# EAGLE design desk-controller (EAGLE 9.6.2)
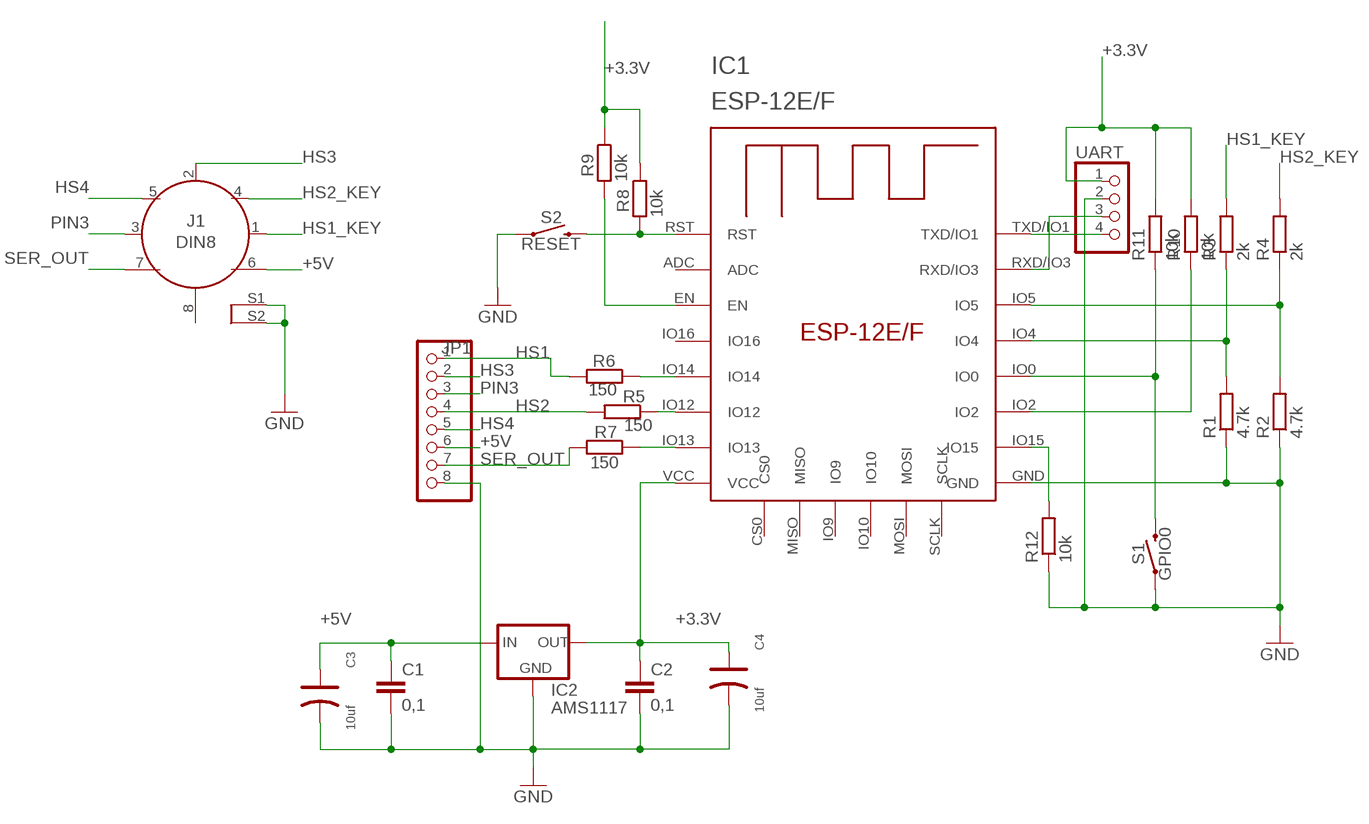
[diagram p0: schematic, sheet 1]

## Parts
C1  0,1  C-EUC1206  [C1206]
C2  0,1  C-EUC1206  [C1206]
C3  10uf  TANTALUM-SMD-10UF-16V-10%(AVX-B)  [AVX-B]
C4  10uf  TANTALUM-SMD-10UF-16V-10%(AVX-B)  [AVX-B]
IC1  ESP-12E/F  [ESP-12E]
IC2  AMS1117  LM1117  [SOT223]
J1  DIN8  [DIN8-RA-PTH]
JP1  PINHD-1X8  [1X08]
R1  4.7k  R-EU_R0805  [R0805]
R2  4.7k  R-EU_R0805  [R0805]
R3  2k  R-EU_R0805  [R0805]
R4  2k  R-EU_R0805  [R0805]
R5  150  R-EU_R0805  [R0805]
R6  150  R-EU_R0805  [R0805]
R7  150  R-EU_R0805  [R0805]
R8  10k  R-EU_R0805  [R0805]
R9  10k  R-EU_R0805  [R0805]
R10  10k  R-EU_R0805  [R0805]
R11  10k  R-EU_R0805  [R0805]
R12  10k  R-EU_R0805  [R0805]
S1  GPIO0  MOMENTARY-SWITCH-SPST-PTH-RIGHT-ANGLE-KIT  [TACTILE_SWITCH_PTH_RIGHT_ANGLE_KIT]
S2  RESET  MOMENTARY-SWITCH-SPST-PTH-RIGHT-ANGLE-KIT  [TACTILE_SWITCH_PTH_RIGHT_ANGLE_KIT]
UART  PINHD-1X4  [1X04]

## Nets
+3.3V: C2.1 C4.+ IC1.VCC IC2.2(OUT) R8.1 R9.1 R10.2 R11.2 UART.1
+5V: C1.1 C3.+ IC2.3(IN) J1.6 JP1.6
GND: C1.2 C2.2 C3.- C4.- IC1.GND IC2.1(GND) J1.S1(SHIELD) J1.S2(SHIELD) JP1.8 R1.1 R2.1 R12.1 S1.1 S2.1 UART.2
HS1: JP1.1 R6.2
HS1_KEY: J1.1 R3.2
HS2: JP1.4 R5.2
HS2_KEY: J1.4 R4.2
HS3: J1.2 JP1.2
HS4: J1.5 JP1.5
N$1: IC1.IO14 R6.1
N$2: IC1.IO12 R5.1
N$3: IC1.IO4 R1.2 R3.1
N$4: IC1.IO5 R2.2 R4.1
N$5: IC1.TXD/IO1 UART.4
N$8: IC1.IO13 R7.1
N$9: IC1.RST R8.2 S2.2
N$10: IC1.EN R9.2
N$11: IC1.IO2 R10.1
N$12: IC1.IO0 R11.1 S1.2
N$13: IC1.RXD/IO3 UART.3
N$14: IC1.IO15 R12.2
PIN3: J1.3 JP1.3
SER_OUT: J1.7 JP1.7 R7.2
Unconnected: IC1.ADC IC1.CS0 IC1.IO9 IC1.IO10 IC1.IO16 IC1.MISO IC1.MOSI IC1.SCLK J1.8

## Library data of the parts
C1 C2 = rcl-2:C-EU: CAPACITOR, European symbol
C3 C4 = Seeed-Capacitor:TANTALUM-SMD-10UF-16V-10%(AVX-B): 302020019; MPN: TAJB106K016RNJ
IC1 = esp-12e-f:ESP-12E/F
IC2 = v-reg-2:LM1117
J1 = my_lbr:DIN8: DIN5 Connector - Female Right Angle (frequently used as a MIDI Jack connector) This type of connector and cable is frequently used for transmitting midi data (musical instrument digital interface). It is what you usually see on a keyboard or set of electronic drums. Learn more here <https://en.wikipedia.org/wiki/MIDI>. For more information on the pinout and electrical specifications of MIDI communications, please see the following resource: https://www.midi.org/specifications/item/midi-din-electrical-specification Here is the connector we sell at SparkFun: MIDI Connector - Female Right Angle <https://www.sparkfun.com/products/9536> (PRT-09536) Datasheet <hhttp://www.sparkfun.com/datasheets/Prototyping/Connectors/MIDI-RA.pdf> It is used on this SparkFun product: SparkFun MIDI Shield <https://www.sparkfun.com/products/12898> (DEV-12898); PROD_ID: CONN-09481
JP1 = pinhead:PINHD-1X8: PIN HEADER
R1-R12 = rcl:R-EU_: RESISTOR, European symbol; SPICEPREFIX: R
S1 S2 = SparkFun-Switches:MOMENTARY-SWITCH-SPST: Momentary Switch (Pushbutton) - SPST Normally-open (NO) SPST momentary switches (buttons, pushbuttons). Variants PTH-12MM - 12mm square, through-hole Momentary Pushbutton Switch - 12mm Square <https://www.sparkfun.com/products/9190> (COM-09190) PTH-6.0MM, PTH-6.0MM-KIT - 6.0mm square, through-hole Mini Pushbutton Switch <https://www.sparkfun.com/products/97> (COM-00097) KIT package intended for soldering kit's - only one side of pads' copper is exposed. PTH-RIGHT-ANGLE-KIT - Right-angle, through-hole Right Angle Tactile Button <https://www.sparkfun.com/products/10791> - Used on SparkFun BigTime Watch Kit <https://www.sparkfun.com/products/11734> SMD-12MM - 12mm square, surface-mount Tactile Button - SMD (12mm) <https://www.sparkfun.com/products/12993> (COM-12993) Used on SparkFun PicoBoard <https://www.sparkfun.com/products/11888> SMD-4.5MM - 4.5mm Square Trackball Switch Used on SparkFun Blackberry Trackballer Breakout <https://www.sparkfun.com/products/13169> SMD-4.6MMX2.8MM - 4.60mm x 2.80mm, surface mount Used on SparkFun SAMD21 Mini Breakout <https://www.sparkfun.com/products/13664> SMD-5.2MM, SMD-5.2-REDUNDANT - 5.2mm square, surface-mount Mini Pushbutton Switch - SMD <https://www.sparkfun.com/products/8720> (COM-08720) Used on Arduino Pro Mini <https://www.sparkfun.com/products/11114> REDUNDANT package connects both switch circuits together SMD-6.0X3.5MM - 6.0 x 3.5mm, surface mount Momentary Reset Switch SMD <https://www.sparkfun.com/products/8229> (COM-08229) SMD-6.2MM-TALL - 6.2mm square, surface mount Tactile Button - SMD (6mm) <https://www.sparkfun.com/products/12992> Used on SparkFun Digital Sandbox <https://www.sparkfun.com/products/12651> SMD-RIGHT-ANGLE - Right-angle, surface mount Used on SparkFun Block for Intel® Edison - Arduino <https://www.sparkfun.com/products/13036>; PROD_ID: CONN-10672; SF_SKU: COM-10791
UART = pinhead:PINHD-1X4: PIN HEADER

## Board
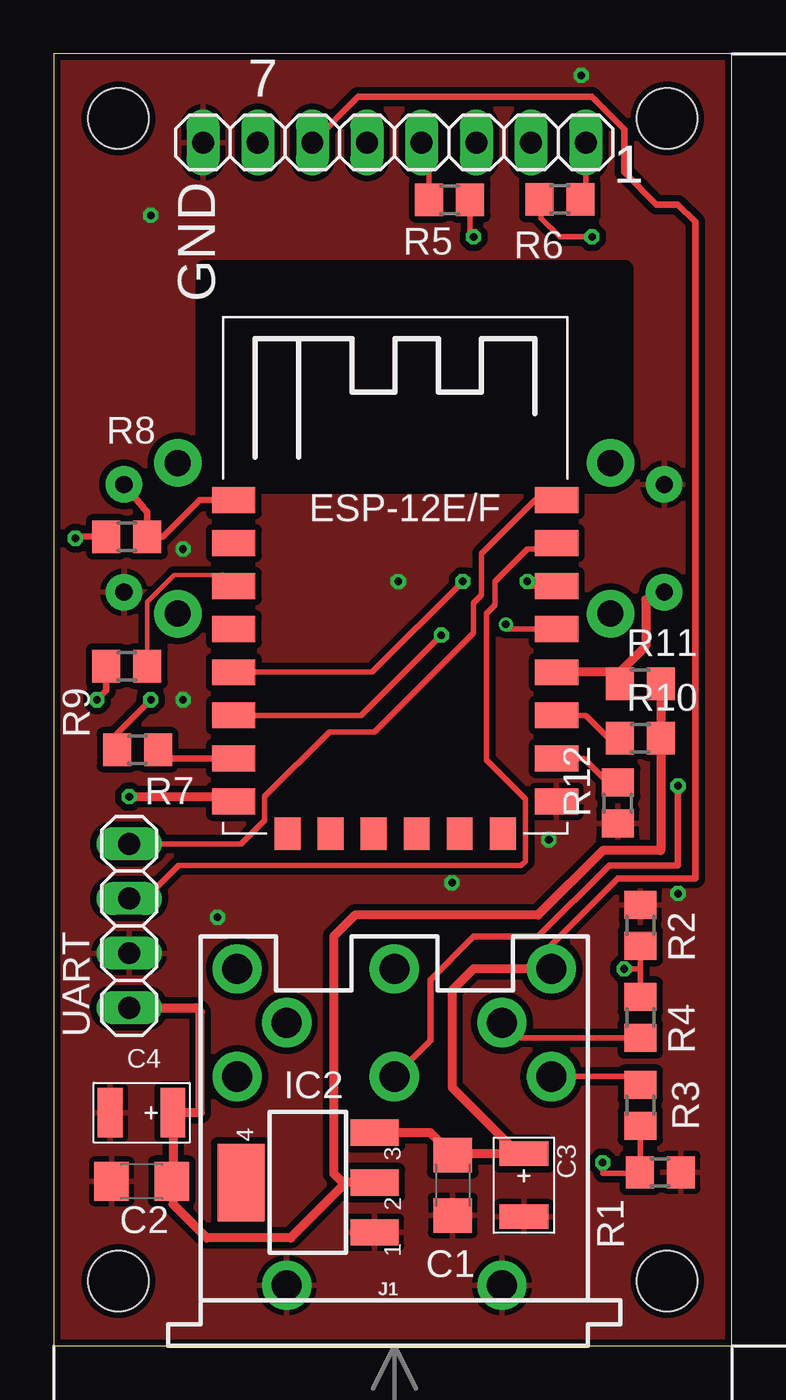
[diagram p1: board, top side]
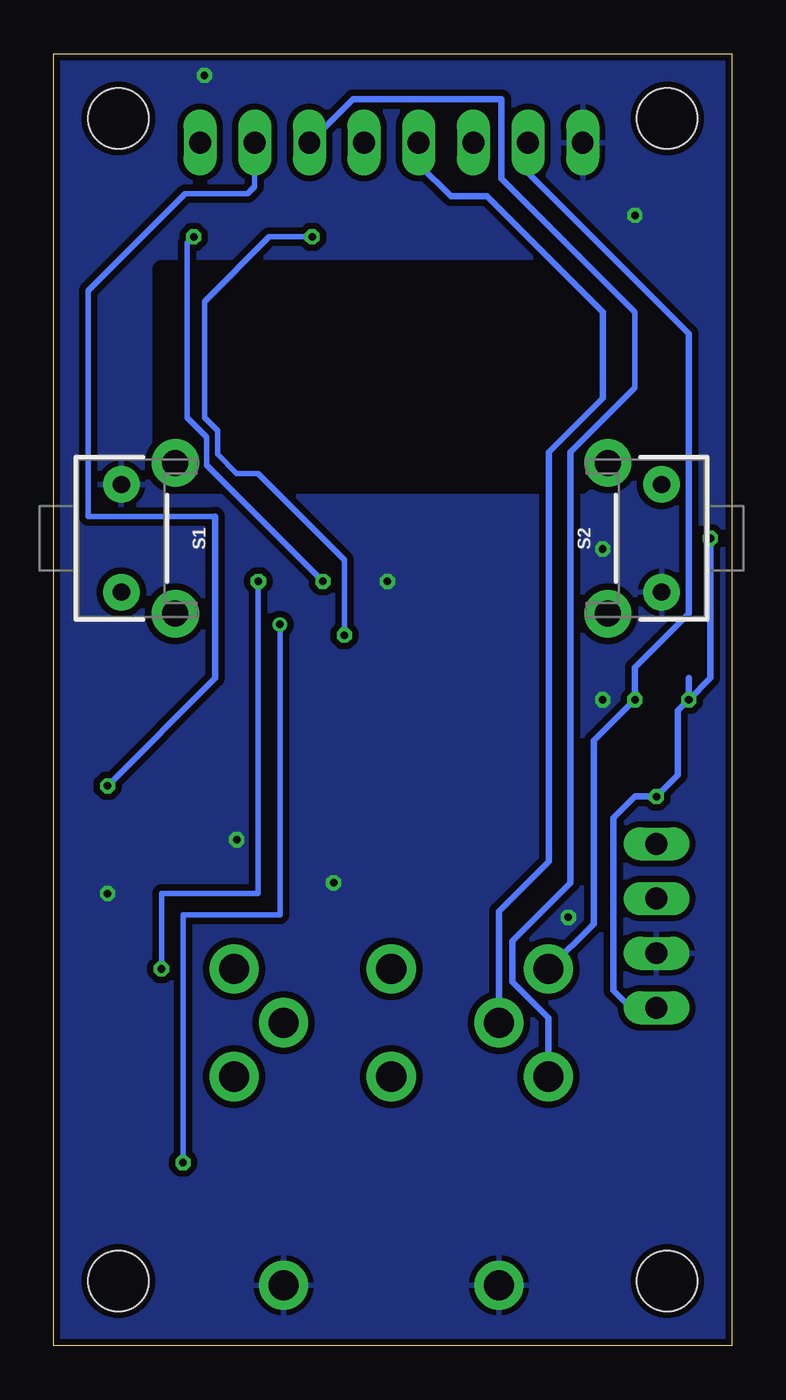
[diagram p2: board, bottom side, seen from below]

Size 31.5 x 60 mm. Coordinates in mm from the lower left corner, seen from the top.
Outline: 0,0 31.5,0 31.5,60 0,60 0,0
Copper layers (1*16): Top 0.035mm / dielectric 1.5mm / Bottom 0.035mm
Design rules "seeed-studio-2-layer": minimum track width 6mil, minimum drill 12mil, track to track 6mil, track to pad 6mil, pad to pad 6mil, via to via 6mil, smd to smd 0mil, copper to edge 10mil, drill to drill 10mil, minimum pad ring 10mil, minimum via ring 6mil, stop-mask expansion 2mil, vias tented up to drill 100mil, thermal gap 10mil
Holes 2.8 mm at 3,57 28.5,3 3,3 28.5,57
tRestrict: area 7,40 to 26.5,50
bRestrict: area 7,40 to 26.5,50

### Footprints (pad centres in the part's own frame; a part is rotated, then mirrored left to right if it is on the bottom)
C1206 = smd 1.6 x 1.8: 1 -1.4,0; 2 1.4,0
AVX-B = smd 1.143 x 2.286: + -1.46,0; - 1.46,0
ESP-12E = smd 2 x 1.2: ADC -7.46,5.53; EN -7.46,3.53; GND 7.54,-6.47; IO0 7.54,-0.47; IO2 7.54,-2.47; IO4 7.54,1.53; IO5 7.54,3.53; IO12 -7.46,-2.47; IO13 -7.46,-4.47; IO14 -7.46,-0.47; IO15 7.54,-4.47; IO16 -7.46,1.53; RST -7.46,7.53; RXD/IO3 7.54,5.53; TXD/IO1 7.54,7.53; VCC -7.46,-6.47 | smd 1.2 x 1.5: CS0 -4.96,-7.97; IO9 -0.96,-7.97; IO10 1.04,-7.97; MISO -2.96,-7.97; MOSI 3.04,-7.97; SCLK 5.04,-7.97
SOT223 = smd 1.219 x 2.235: 1 -2.311,-3.099; 2 0,-3.099; 3 2.311,-3.099 | smd 3.6 x 2.2: 4 0,3.099
DIN8-RA-PTH = drill 1.4 pad 2.286: 1 7.3,12.5; 2 0,12.5; 3 -7.3,12.5; 4 5,15; 5 -5,15; 6 7.3,17.5; 7 -7.3,17.5; 8 0,17.5; S1 -5,2.8; S2 5,2.8
1X08 = drill 1.016 long: 1 -8.89,0; 2 -6.35,0; 3 -3.81,0; 4 -1.27,0; 5 1.27,0; 6 3.81,0; 7 6.35,0; 8 8.89,0
R0805 = smd 1.3 x 1.5: 1 -0.95,0; 2 0.95,0
TACTILE_SWITCH_PTH_RIGHT_ANGLE_KIT = drill 0.8 pad 1.7: 1 -2.5,0; 2 2.5,0 | drill 1.2 pad 2.2: ANCHOR1 -3.5,2.5; ANCHOR2 3.5,2.5
1X04 = drill 1.016 long: 1 -3.81,0; 2 -1.27,0; 3 1.27,0; 4 3.81,0

### Placement (x,y rotation side)
C1  18.53,7.45 270 top
C2  4.08,7.63 180 top
C3  21.84,7.45 270 top
C4  4.08,10.82 180 top
IC1  15.82,31.75 0 top
IC2  11.8,7.58 90 top
J1  15.82,0 0 top
JP1  15.82,55.88 180 top
R1  28.18,8.05 180 top
R2  27.25,19.52 270 top
R3  27.25,11.16 90 top
R4  27.25,15.24 270 top
R5  18.39,53.21 180 top
R6  23.51,53.23 0 top
R7  3.89,27.68 180 top
R8  3.39,37.57 0 top
R9  3.39,31.56 0 top
R10  27.25,28.21 0 top
R11  27.25,30.75 0 top
R12  26.2,25.2 90 top
S1  28.36,37.5 270 bottom
S2  3.26,37.5 90 bottom
UART  3.5,19.5 90 top

### Tracks (layer width: path | path; a pad name or v marks a point on that pad's centre or on a via)
+3.3V  (via drill 0.35 pad 0.7)
  Top 0.305: R9.1 2.44,30.44 v2,30 | v1,37.5 1.07,37.57 R8.1
  Top 0.406: IC1.VCC 8.32,25.32 8,25.32 7.82,25.5 v3.5,25.5 | R11.2 R10.2 28.2,23 25.5,23 22.5,20 14,20 13,19 13,8 13.42,7.58 IC2.2 13.58,7.58 11,5 7.11,5 5.54,6.57 5.54,7.57 | 5.54,7.57 C2.1 | 5.54,7.57 C4.+ 6.8,10.82 6.8,15.5 6.61,15.69 UART.1
  Bottom 0.305: UART.1 4.69,15.69 5.5,16.5 5.5,24.5 4.5,25.5 v3.5,25.5 2.5,26.5 2.5,29.5 v2,30 | v2,30 2,31 | v2,30 1,31 v1,37.5
+5V
  Top 0.305: J1.6 23.12,18.62 26.2,21.7 29.8,21.7 29.8,52.2 29,53 28,53 26.5,54.5 26.5,56.5 25,58 14.13,58 JP1.6
  Top 0.406: J1.6 19.5,17.5 18.5,16.5 18.5,12 21.59,8.91 C3.+ 18.59,8.91 C1.1 17.49,9.89 IC2.3
GND  (via drill 0.35 pad 0.7)
  other vias: 29,21 7.6,19.9 18.5,21.5 16,35.5 24.5,59 4.5,52.5 6,37 6,30 23,23.5
  pour Top (isolate 0.3): -13,-4 50,-4 50,66.5 -13,66.5
  pour Bottom (isolate 0.3): -11.5,-5.5 51.5,-5.5 51.5,65 -11.5,65
HS1
  Top 0.254: JP1.1 24.71,53.48 R6.2
HS1_KEY
  Top 0.254: J1.1 26.86,12.5 R3.2
HS2
  Top 0.254: JP1.4 17.44,55.53 R5.2
HS2_KEY
  Top 0.254: J1.4 21.53,14.29 R4.2
HS3  (via drill 0.35 pad 0.7)
  Top 0.305: J1.2 17.5,14.18 17.5,17 19.5,19 22.5,19 25.8,22.3 29,22.3 v29,26
  Bottom 0.254: 24,38.5 29.9,38.5 29.9,49 25.4,53.5 22.5,53.5 22.17,53.83 JP1.2
  Bottom 0.305: v29,26 24,31 24,38.5
HS4
  Bottom 0.305: J1.5 10.82,20.18 8.5,22.5 8.5,41.5 6,44 6,48 11.38,53.38 13.05,53.38 14.55,54.88 JP1.5
N$1  (via drill 0.35 pad 0.7)
  Top 0.254: IC1.IO14 14.78,31.28 v19,35.5 | R6.1 22.63,53.23 22.63,52.37 23.5,51.5 v25,51.5
  Bottom 0.254: v19,35.5 24.4,40.9 24.4,42.2 25.3,43.1 25.3,51.2 v25,51.5
N$2  (via drill 0.35 pad 0.7)
  Top 0.254: IC1.IO12 14.28,29.28 v18,33 | v19.5,51.5 19.37,51.5 19.34,51.53 R5.1
  Bottom 0.254: v18,33 18,36.5 22,40.5 23,40.5 23.9,41.4 23.9,42.5 24.5,43.1 24.5,48.5 21.5,51.5 v19.5,51.5
N$3  (via drill 0.35, 0.35 pad 0.7)
  Top 0.254: R3.1 27.25,8 | 27.25,8 R1.2 | IC1.IO4 21,33.28 v21,33.5 | v25.5,8.5 25.5,8 27.25,8
  Bottom 0.254: v21,33.5 21,20 25.5,20 v25.5,8.5
N$4  (via drill 0.35 pad 0.7)
  Top 0.254: R4.1 27.25,17.5 | 27.25,17.5 R2.2 | IC1.IO5 22,35.28 v22,35.5 | v26.5,17.5 27.25,17.5
  Bottom 0.254: v22,35.5 22,21 26.5,21 v26.5,17.5
N$5
  Top 0.254: UART.4 8.71,23.31 9.8,24.4 9.8,25.5 12.8,28.5 14.9,28.5 19.5,33.1 19.5,34.5 19.86,34.86 19.86,36.78 22.36,39.28 IC1.TXD/IO1
N$8
  Top 0.305: IC1.IO13 5.24,27.28 R7.1
N$9
  Top 0.305: S2.2 4.34,38.71 R8.2 5.07,37.57 6.78,39.28 IC1.RST
N$10
  Top 0.2: 4.34,34.54 5.6,35.8
  Top 0.203: R9.2 4.34,34.54 | 5.6,35.8 7.84,35.8
  Top 0.254: 7.84,35.8 IC1.EN
N$11
  Top 0.254: IC1.IO2 24.72,29.28 25.79,28.21 R10.1
N$12
  Top 0.406: S1.2 27.5,34.64 27.5,32.5 26.3,31.3 R11.1 25.83,31.28 IC1.IO0
N$13
  Top 0.254: IC1.RXD/IO3 23.08,37 22,37 20.5,35.5 20.5,34.4 20.1,34 20.1,27.2 21.9,25.4 21.9,22.5 21.7,22.3 5.8,22.3 4.27,20.77 UART.3
N$14
  Top 0.254: IC1.IO15 24.62,27.28 25.75,26.15 R12.2
PIN3
  Bottom 0.254: 7.5,41.5 4.5,44.5 4.5,48 10.7,54.2
  Bottom 0.305: J1.3 8.52,15.22 10.2,16.9 10.2,18.8 7.5,21.5 7.5,25.5 7.5,41.5 | 10.7,54.2 10.7,57.9 17.61,57.9 JP1.3
SER_OUT  (via drill 0.35 pad 0.7)
  Top 0.305: R7.2 2.94,28.44 v4.5,30
  Bottom 0.305: J1.7 6.42,19.6 6.42,28.1 4.52,30 v4.5,30 4.5,31.5 2,34 2,47 9.5,54.5 9.5,55.85 JP1.7

### Text on the board
tNames: 7 | 1 | GND